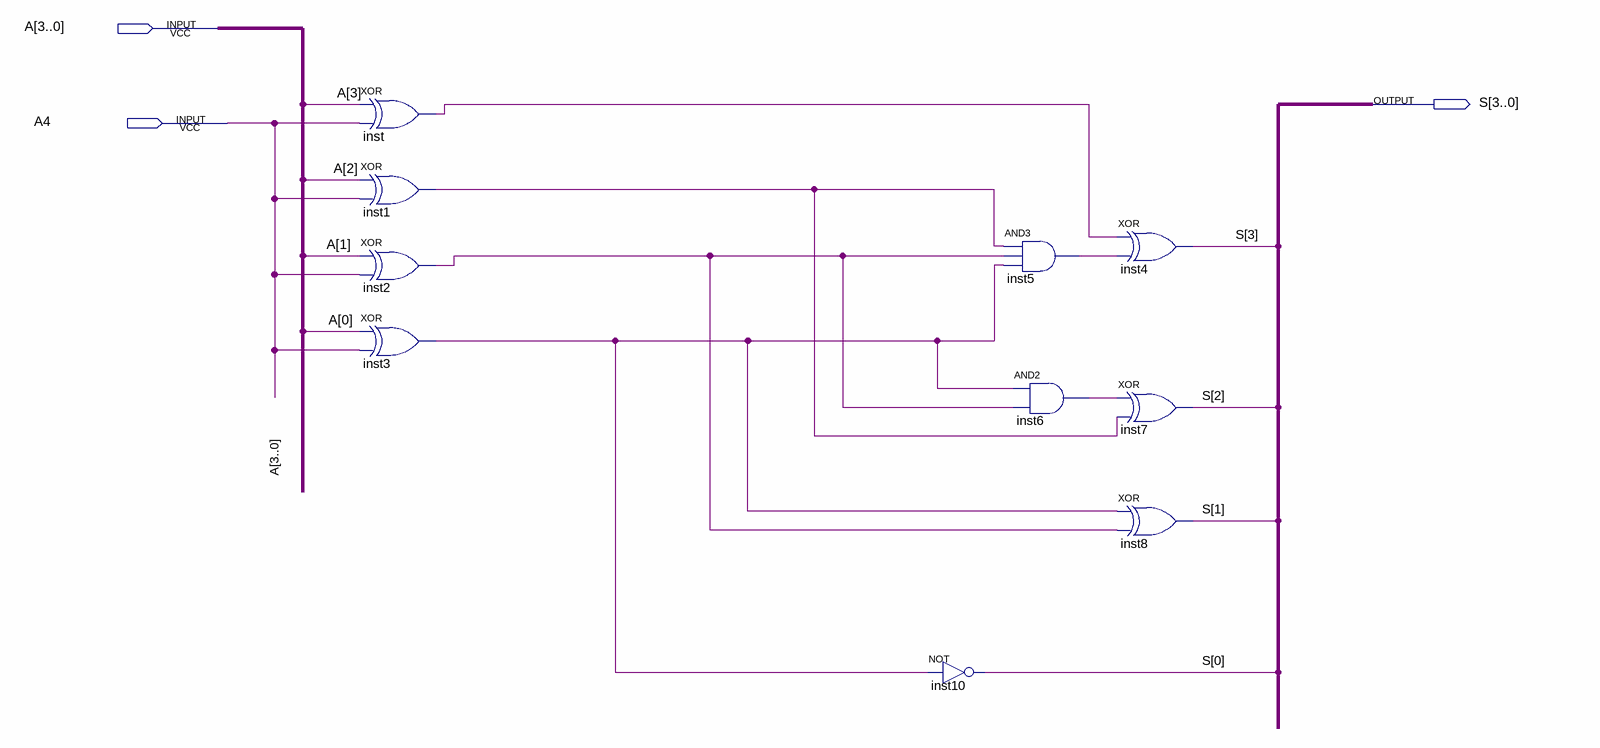
[diagram p0: schematic sheet]
// Quartus schematic complemento2.bdf as structural Verilog: 10 symbols, 3 pins
module complemento2 (
  input  [3:0] A,
  input  A4,
  output [3:0] S
);

  wire inst1_out, inst2_out, inst3_out, inst5_out, inst6_out, inst_out;

  xor inst (inst_out, A[3], A4);
  xor inst1 (inst1_out, A[2], A4);
  xor inst2 (inst2_out, A[1], A4);
  xor inst3 (inst3_out, A[0], A4);
  not inst10 (S[0], inst3_out);
  and inst5 (inst5_out, inst1_out, inst2_out, inst3_out);
  and inst6 (inst6_out, inst3_out, inst2_out);
  xor inst4 (S[3], inst_out, inst5_out);
  xor inst7 (S[2], inst6_out, inst1_out);
  xor inst8 (S[1], inst3_out, inst2_out);
endmodule
